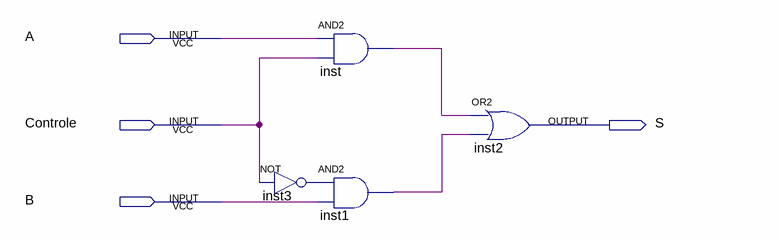
[diagram p0: schematic sheet]
// Quartus schematic MUX.bdf as structural Verilog: 4 symbols, 4 pins
module MUX (
  input  A,
  input  Controle,
  input  B,
  output S
);

  wire inst1_out, inst3_out, inst_out;

  and inst (inst_out, A, Controle);
  and inst1 (inst1_out, inst3_out, B);
  not inst3 (inst3_out, Controle);
  or inst2 (S, inst_out, inst1_out);
endmodule
